# EAGLE schematic button_fingers (EAGLE 7.6.0)
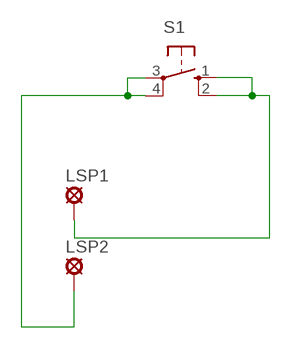
[diagram p0: schematic, sheet 1]

## Parts
LSP1  SE14  [SE14]
LSP2  SE14  [SE14]
S1  10-XX  [B3F-10XX]

## Nets
N$1: LSP1.MP S1.1(S) S1.2(S1)
N$2: LSP2.MP S1.3(P) S1.4(P1)

## Library data of the parts
LSP1 LSP2 = solpad:SE14: SOLDER PAD E1553, drill 1,4mm, distributor Buerklin, 07F820
S1 = switch-omron:10-XX: OMRON SWITCH; MPN: B3F-1000; OC_FARNELL: 176432; OC_NEWARK: 36M3542